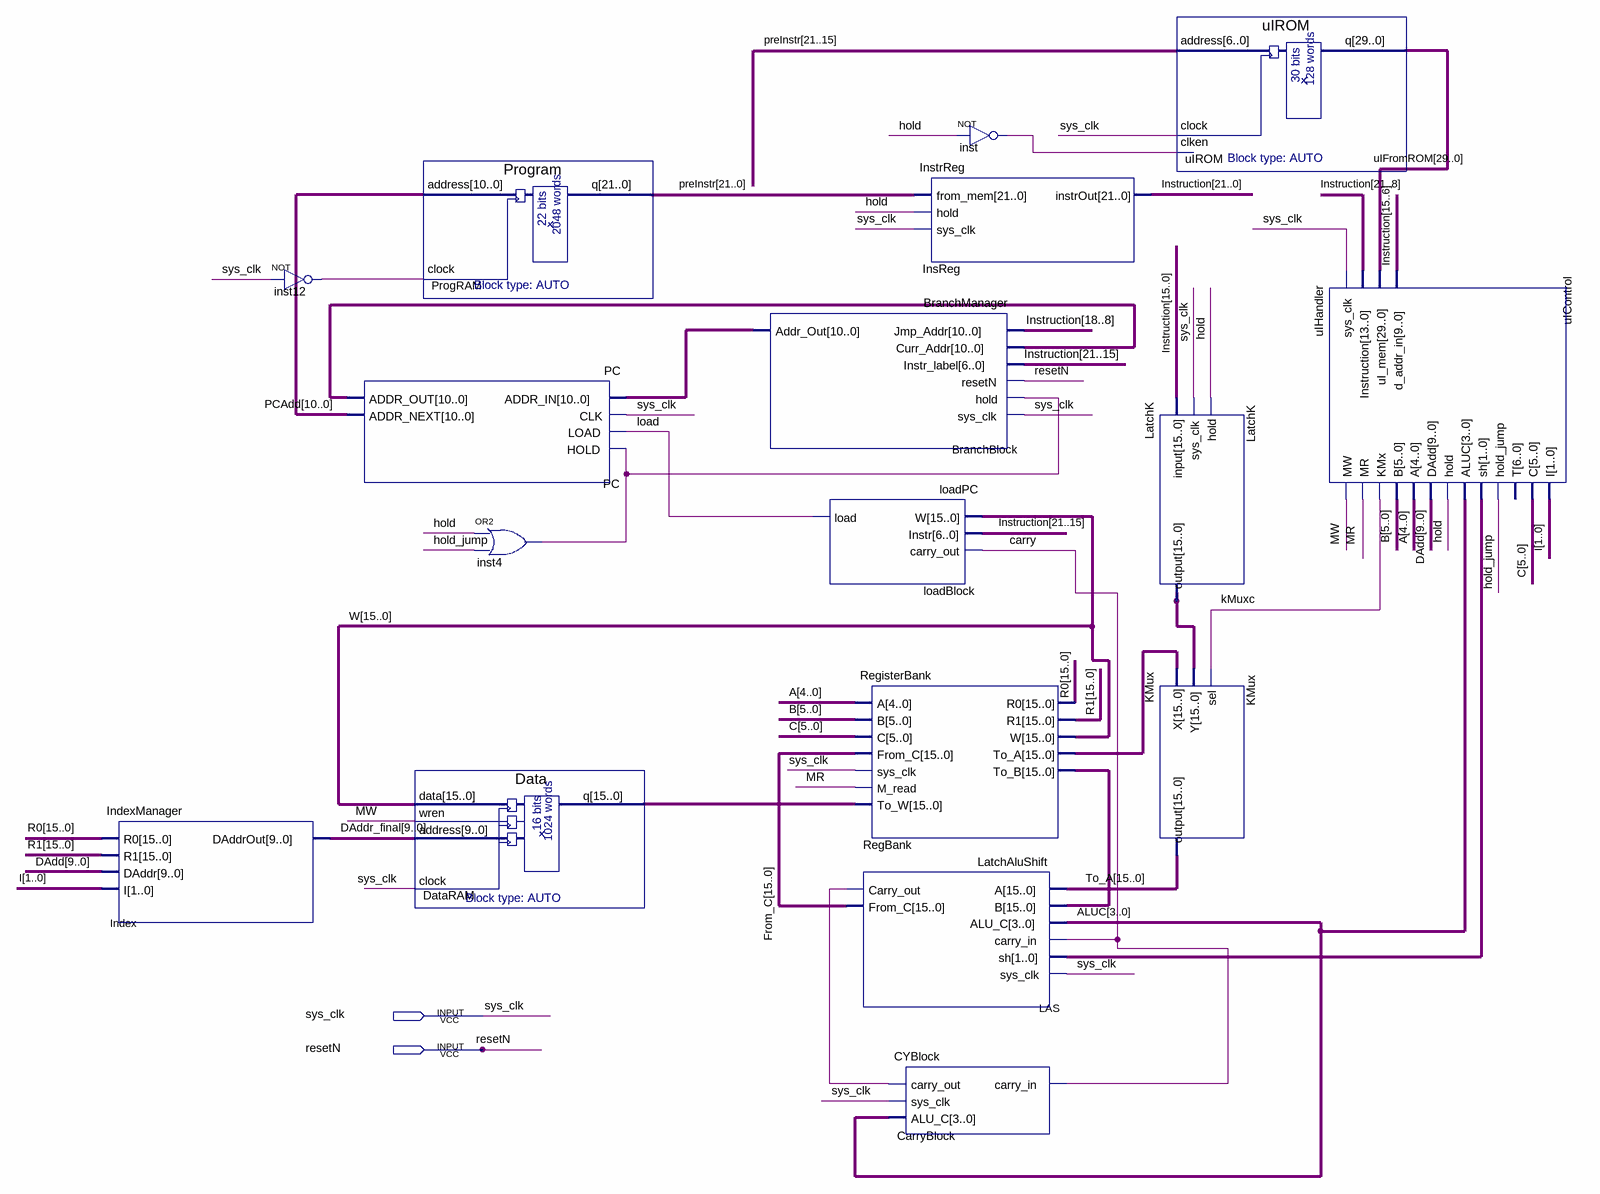
[diagram p0: schematic sheet]
// Quartus schematic EV20.bdf as structural Verilog: 17 symbols, 2 pins
module EV20 (
  input  sys_clk,
  input  resetN
);

  wire carry, hold, hold_jump, inst4_out, inst12_out, inst_out, kMuxc, LAS_carry_out, load, MR, MW;
  wire [1:0] I, uIControl_sh;
  wire [3:0] ALUC;
  wire [4:0] A;
  wire [5:0] B, C;
  wire [9:0] DAdd, DAddr_final;
  wire [10:0] BranchBlock_addr_out, PC_addr_out, PCAdd;
  wire [15:0] DataRAM_q, From_C, LatchK_output, R0, R1, RegBank_to_a, RegBank_to_b, To_A, W;
  wire [21:0] Instruction, preInstr;
  wire [29:0] uIFromROM;

  IndexManager Index (.R0(R0), .R1(R1), .DAddr(DAdd), .I(I), .DAddrOut(DAddr_final));
  not inst12 (inst12_out, sys_clk);
  PC PC (
    .ADDR_IN(BranchBlock_addr_out), .CLK(sys_clk), .LOAD(load), .HOLD(inst4_out), .ADDR_OUT(PC_addr_out),
    .ADDR_NEXT(PCAdd));
  Program ProgRAM (.address(PCAdd), .clock(inst12_out), .q(preInstr));
  or inst4 (inst4_out, hold, hold_jump);
  Data DataRAM (.data(W), .wren(MW), .address(DAddr_final), .clock(sys_clk), .q(DataRAM_q));
  BranchManager BranchBlock (
    .Jmp_Addr(Instruction[18:8]), .Curr_Addr(PC_addr_out), .Instr_label(Instruction[21:15]), .resetN(resetN),
    .hold(inst4_out), .sys_clk(sys_clk), .Addr_Out(BranchBlock_addr_out));
  loadPC loadBlock (.W(W), .Instr(Instruction[21:15]), .carry_out(carry), .load(load));
  RegisterBank RegBank (
    .A(A), .B(B), .C(C), .From_C(From_C), .sys_clk(sys_clk), .M_read(MR), .To_W(DataRAM_q), .R0(R0), .R1(R1),
    .W(W), .To_A(RegBank_to_a), .To_B(RegBank_to_b));
  LatchAluShift LAS (
    .A(To_A), .B(RegBank_to_b), .ALU_C(ALUC), .carry_in(carry), .sh(uIControl_sh), .sys_clk(sys_clk),
    .Carry_out(LAS_carry_out), .From_C(From_C));
  InstrReg InsReg (.from_mem(preInstr), .hold(hold), .sys_clk(sys_clk), .instrOut(Instruction));
  CYBlock CarryBlock (.carry_out(LAS_carry_out), .sys_clk(sys_clk), .ALU_C(ALUC), .carry_in(carry));
  not inst (inst_out, hold);
  LatchK LatchK (.\input (Instruction[15:0]), .sys_clk(sys_clk), .hold(hold), .\output (LatchK_output));
  KMux KMux (.X(RegBank_to_a), .Y(LatchK_output), .sel(kMuxc), .\output (To_A));
  uIROM uIROM (.address(preInstr[21:15]), .clock(sys_clk), .clken(inst_out), .q(uIFromROM));
  uIHandler uIControl (
    .sys_clk(sys_clk), .Instruction(Instruction[21:8]), .uI_mem(uIFromROM), .d_addr_in(Instruction[15:6]),
    .MW(MW), .MR(MR), .KMx(kMuxc), .B(B), .A(A), .DAdd(DAdd), .hold(hold), .ALUC(ALUC), .sh(uIControl_sh),
    .hold_jump(hold_jump), .C(C), .I(I));  // open: T
endmodule
